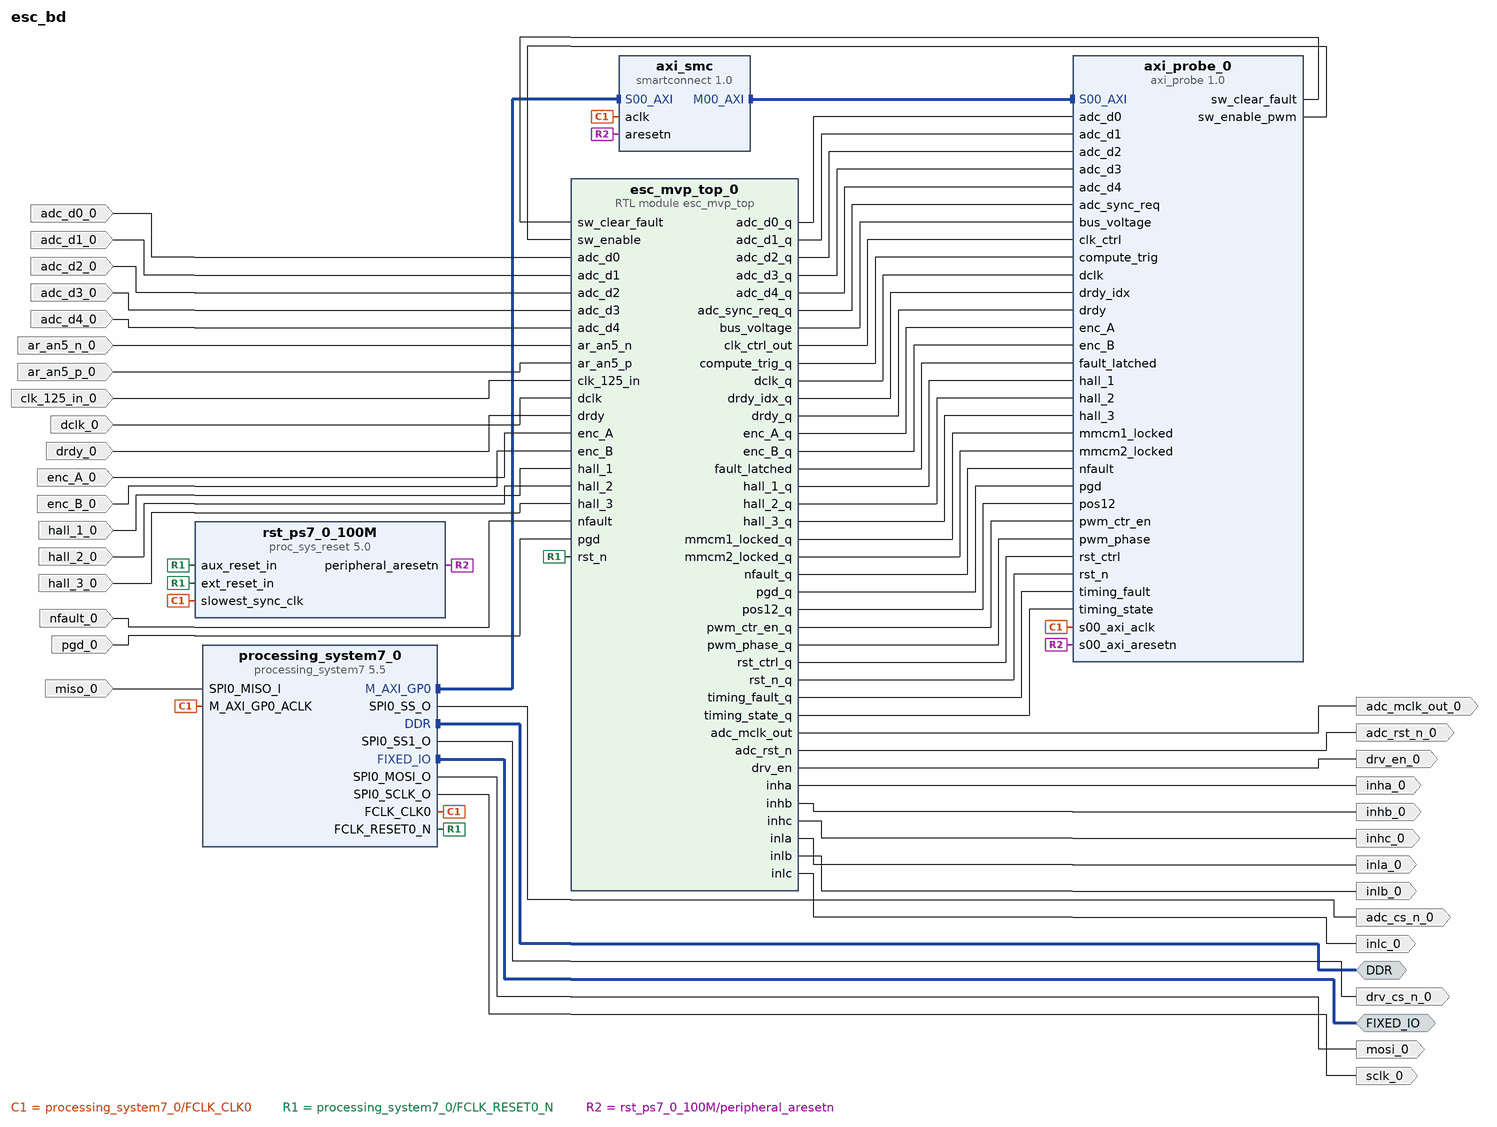
[diagram p0: block diagram of the top level]
# Vivado block design esc_bd, xc7z020clg400-1, Vivado 2024.2
create_bd_design esc_bd

create_bd_intf_port -mode Master -vlnv xilinx.com:interface:ddrx_rtl:1.0 DDR
create_bd_intf_port -mode Master -vlnv xilinx.com:display_processing_system7:fixedio_rtl:1.0 FIXED_IO
create_bd_port -dir I clk_125_in_0
create_bd_port -dir I dclk_0
create_bd_port -dir I hall_2_0
create_bd_port -dir I enc_B_0
create_bd_port -dir I enc_A_0
create_bd_port -dir I ar_an5_p_0
create_bd_port -dir I adc_d4_0
create_bd_port -dir I adc_d1_0
create_bd_port -dir I adc_d0_0
create_bd_port -dir I hall_1_0
create_bd_port -dir I ar_an5_n_0
create_bd_port -dir I adc_d3_0
create_bd_port -dir I adc_d2_0
create_bd_port -dir I drdy_0
create_bd_port -dir I miso_0
create_bd_port -dir I hall_3_0
create_bd_port -dir I nfault_0
create_bd_port -dir I pgd_0
create_bd_port -dir O sclk_0
create_bd_port -dir O drv_en_0
create_bd_port -dir O inha_0
create_bd_port -dir O adc_mclk_out_0
create_bd_port -dir O inlb_0
create_bd_port -dir O inhc_0
create_bd_port -dir O drv_cs_n_0
create_bd_port -dir O mosi_0
create_bd_port -dir O inla_0
create_bd_port -dir O inhb_0
create_bd_port -dir O inlc_0
create_bd_port -dir O adc_cs_n_0
create_bd_port -dir O -type rst adc_rst_n_0

create_bd_cell -type ip -vlnv xilinx.com:ip:processing_system7:5.5 processing_system7_0
set_property -dict [list \
  CONFIG.PCW_APU_PERIPHERAL_FREQMHZ 650 \
  CONFIG.PCW_CRYSTAL_PERIPHERAL_FREQMHZ 50 \
  CONFIG.PCW_ENET0_ENET0_IO {MIO 16 .. 27} \
  CONFIG.PCW_ENET0_GRP_MDIO_ENABLE 1 \
  CONFIG.PCW_ENET0_GRP_MDIO_IO {MIO 52 .. 53} \
  CONFIG.PCW_ENET0_PERIPHERAL_ENABLE 1 \
  CONFIG.PCW_ENET0_RESET_ENABLE 1 \
  CONFIG.PCW_ENET0_RESET_IO {MIO 9} \
  CONFIG.PCW_ENET_RESET_ENABLE 1 \
  CONFIG.PCW_ENET_RESET_SELECT {Share reset pin} \
  CONFIG.PCW_FPGA0_PERIPHERAL_FREQMHZ 100 \
  CONFIG.PCW_FPGA1_PERIPHERAL_FREQMHZ 50 \
  CONFIG.PCW_GPIO_MIO_GPIO_ENABLE 1 \
  CONFIG.PCW_GPIO_MIO_GPIO_IO MIO \
  CONFIG.PCW_I2C_RESET_ENABLE 1 \
  CONFIG.PCW_M_AXI_GP0_FREQMHZ 10 \
  CONFIG.PCW_PERIPHERAL_BOARD_PRESET part0 \
  CONFIG.PCW_PRESET_BANK1_VOLTAGE {LVCMOS 1.8V} \
  CONFIG.PCW_QSPI_GRP_FBCLK_ENABLE 1 \
  CONFIG.PCW_QSPI_GRP_FBCLK_IO {MIO 8} \
  CONFIG.PCW_QSPI_GRP_SINGLE_SS_ENABLE 1 \
  CONFIG.PCW_QSPI_GRP_SINGLE_SS_IO {MIO 1 .. 6} \
  CONFIG.PCW_QSPI_PERIPHERAL_ENABLE 1 \
  CONFIG.PCW_QSPI_QSPI_IO {MIO 1 .. 6} \
  CONFIG.PCW_SD0_GRP_CD_ENABLE 1 \
  CONFIG.PCW_SD0_GRP_CD_IO {MIO 47} \
  CONFIG.PCW_SD0_GRP_WP_ENABLE 0 \
  CONFIG.PCW_SD0_PERIPHERAL_ENABLE 1 \
  CONFIG.PCW_SD0_SD0_IO {MIO 40 .. 45} \
  CONFIG.PCW_SDIO_PERIPHERAL_FREQMHZ 50 \
  CONFIG.PCW_SINGLE_QSPI_DATA_MODE x4 \
  CONFIG.PCW_SPI0_PERIPHERAL_ENABLE 1 \
  CONFIG.PCW_SPI0_SPI0_IO EMIO \
  CONFIG.PCW_UART0_PERIPHERAL_ENABLE 1 \
  CONFIG.PCW_UART0_UART0_IO {MIO 14 .. 15} \
  CONFIG.PCW_UART1_PERIPHERAL_ENABLE 0 \
  CONFIG.PCW_UART_PERIPHERAL_FREQMHZ 100 \
  CONFIG.PCW_UIPARAM_DDR_BUS_WIDTH {16 Bit} \
  CONFIG.PCW_UIPARAM_DDR_FREQ_MHZ 525 \
  CONFIG.PCW_UIPARAM_DDR_PARTNO {MT41J256M16 RE-125} \
  CONFIG.PCW_USB0_PERIPHERAL_ENABLE 1 \
  CONFIG.PCW_USB0_RESET_ENABLE 1 \
  CONFIG.PCW_USB0_RESET_IO {MIO 46} \
  CONFIG.PCW_USB0_USB0_IO {MIO 28 .. 39} \
  CONFIG.PCW_USB_RESET_ENABLE 1 \
  CONFIG.PCW_USB_RESET_SELECT {Share reset pin} \
] [get_bd_cells processing_system7_0]
# 481 more settings of processing_system7_0 are not shown: defaults, MIO pin electricals, DDR timing, and values the tool derives
create_bd_cell -type ip -vlnv xilinx.com:user:axi_probe:1.0 axi_probe_0
create_bd_cell -type ip -vlnv xilinx.com:ip:smartconnect:1.0 axi_smc
set_property -dict {CONFIG.NUM_SI 1} [get_bd_cells axi_smc]
create_bd_cell -type ip -vlnv xilinx.com:ip:proc_sys_reset:5.0 rst_ps7_0_100M
create_bd_cell -type module -reference esc_mvp_top esc_mvp_top_0

# ---- connections ----

connect_bd_intf_net [get_bd_intf_pins axi_smc/M00_AXI] [get_bd_intf_pins axi_probe_0/S00_AXI]
connect_bd_intf_net [get_bd_intf_ports DDR] [get_bd_intf_pins processing_system7_0/DDR]
connect_bd_intf_net [get_bd_intf_ports FIXED_IO] [get_bd_intf_pins processing_system7_0/FIXED_IO]
connect_bd_intf_net [get_bd_intf_pins processing_system7_0/M_AXI_GP0] [get_bd_intf_pins axi_smc/S00_AXI]
connect_bd_net -net adc_d0_0_1 [get_bd_ports adc_d0_0] [get_bd_pins esc_mvp_top_0/adc_d0]
connect_bd_net -net adc_d1_0_1 [get_bd_ports adc_d1_0] [get_bd_pins esc_mvp_top_0/adc_d1]
connect_bd_net -net adc_d2_0_1 [get_bd_ports adc_d2_0] [get_bd_pins esc_mvp_top_0/adc_d2]
connect_bd_net -net adc_d3_0_1 [get_bd_ports adc_d3_0] [get_bd_pins esc_mvp_top_0/adc_d3]
connect_bd_net -net adc_d4_0_1 [get_bd_ports adc_d4_0] [get_bd_pins esc_mvp_top_0/adc_d4]
connect_bd_net -net ar_an5_n_0_1 [get_bd_ports ar_an5_n_0] [get_bd_pins esc_mvp_top_0/ar_an5_n]
connect_bd_net -net ar_an5_p_0_1 [get_bd_ports ar_an5_p_0] [get_bd_pins esc_mvp_top_0/ar_an5_p]
connect_bd_net [get_bd_pins axi_probe_0/sw_clear_fault] [get_bd_pins esc_mvp_top_0/sw_clear_fault]
connect_bd_net [get_bd_pins axi_probe_0/sw_enable_pwm] [get_bd_pins esc_mvp_top_0/sw_enable]
connect_bd_net -net clk_125_in_0_1 [get_bd_ports clk_125_in_0] [get_bd_pins esc_mvp_top_0/clk_125_in]
connect_bd_net -net dclk_0_1 [get_bd_ports dclk_0] [get_bd_pins esc_mvp_top_0/dclk]
connect_bd_net -net drdy_0_1 [get_bd_ports drdy_0] [get_bd_pins esc_mvp_top_0/drdy]
connect_bd_net -net enc_A_0_1 [get_bd_ports enc_A_0] [get_bd_pins esc_mvp_top_0/enc_A]
connect_bd_net -net enc_B_0_1 [get_bd_ports enc_B_0] [get_bd_pins esc_mvp_top_0/enc_B]
connect_bd_net [get_bd_pins esc_mvp_top_0/adc_d0_q] [get_bd_pins axi_probe_0/adc_d0]
connect_bd_net [get_bd_pins esc_mvp_top_0/adc_d1_q] [get_bd_pins axi_probe_0/adc_d1]
connect_bd_net [get_bd_pins esc_mvp_top_0/adc_d2_q] [get_bd_pins axi_probe_0/adc_d2]
connect_bd_net [get_bd_pins esc_mvp_top_0/adc_d3_q] [get_bd_pins axi_probe_0/adc_d3]
connect_bd_net [get_bd_pins esc_mvp_top_0/adc_d4_q] [get_bd_pins axi_probe_0/adc_d4]
connect_bd_net [get_bd_pins esc_mvp_top_0/adc_mclk_out] [get_bd_ports adc_mclk_out_0]
connect_bd_net [get_bd_pins esc_mvp_top_0/adc_rst_n] [get_bd_ports adc_rst_n_0]
connect_bd_net [get_bd_pins esc_mvp_top_0/adc_sync_req_q] [get_bd_pins axi_probe_0/adc_sync_req]
connect_bd_net [get_bd_pins esc_mvp_top_0/bus_voltage] [get_bd_pins axi_probe_0/bus_voltage]
connect_bd_net [get_bd_pins esc_mvp_top_0/clk_ctrl_out] [get_bd_pins axi_probe_0/clk_ctrl]
connect_bd_net [get_bd_pins esc_mvp_top_0/compute_trig_q] [get_bd_pins axi_probe_0/compute_trig]
connect_bd_net [get_bd_pins esc_mvp_top_0/dclk_q] [get_bd_pins axi_probe_0/dclk]
connect_bd_net [get_bd_pins esc_mvp_top_0/drdy_idx_q] [get_bd_pins axi_probe_0/drdy_idx]
connect_bd_net [get_bd_pins esc_mvp_top_0/drdy_q] [get_bd_pins axi_probe_0/drdy]
connect_bd_net [get_bd_pins esc_mvp_top_0/drv_en] [get_bd_ports drv_en_0]
connect_bd_net [get_bd_pins esc_mvp_top_0/enc_A_q] [get_bd_pins axi_probe_0/enc_A]
connect_bd_net [get_bd_pins esc_mvp_top_0/enc_B_q] [get_bd_pins axi_probe_0/enc_B]
connect_bd_net [get_bd_pins esc_mvp_top_0/fault_latched] [get_bd_pins axi_probe_0/fault_latched]
connect_bd_net [get_bd_pins esc_mvp_top_0/hall_1_q] [get_bd_pins axi_probe_0/hall_1]
connect_bd_net [get_bd_pins esc_mvp_top_0/hall_2_q] [get_bd_pins axi_probe_0/hall_2]
connect_bd_net [get_bd_pins esc_mvp_top_0/hall_3_q] [get_bd_pins axi_probe_0/hall_3]
connect_bd_net [get_bd_pins esc_mvp_top_0/inha] [get_bd_ports inha_0]
connect_bd_net [get_bd_pins esc_mvp_top_0/inhb] [get_bd_ports inhb_0]
connect_bd_net [get_bd_pins esc_mvp_top_0/inhc] [get_bd_ports inhc_0]
connect_bd_net [get_bd_pins esc_mvp_top_0/inla] [get_bd_ports inla_0]
connect_bd_net [get_bd_pins esc_mvp_top_0/inlb] [get_bd_ports inlb_0]
connect_bd_net [get_bd_pins esc_mvp_top_0/inlc] [get_bd_ports inlc_0]
connect_bd_net [get_bd_pins esc_mvp_top_0/mmcm1_locked_q] [get_bd_pins axi_probe_0/mmcm1_locked]
connect_bd_net [get_bd_pins esc_mvp_top_0/mmcm2_locked_q] [get_bd_pins axi_probe_0/mmcm2_locked]
connect_bd_net [get_bd_pins esc_mvp_top_0/nfault_q] [get_bd_pins axi_probe_0/nfault]
connect_bd_net [get_bd_pins esc_mvp_top_0/pgd_q] [get_bd_pins axi_probe_0/pgd]
connect_bd_net [get_bd_pins esc_mvp_top_0/pos12_q] [get_bd_pins axi_probe_0/pos12]
connect_bd_net [get_bd_pins esc_mvp_top_0/pwm_ctr_en_q] [get_bd_pins axi_probe_0/pwm_ctr_en]
connect_bd_net [get_bd_pins esc_mvp_top_0/pwm_phase_q] [get_bd_pins axi_probe_0/pwm_phase]
connect_bd_net [get_bd_pins esc_mvp_top_0/rst_ctrl_q] [get_bd_pins axi_probe_0/rst_ctrl]
connect_bd_net [get_bd_pins esc_mvp_top_0/rst_n_q] [get_bd_pins axi_probe_0/rst_n]
connect_bd_net [get_bd_pins esc_mvp_top_0/timing_fault_q] [get_bd_pins axi_probe_0/timing_fault]
connect_bd_net [get_bd_pins esc_mvp_top_0/timing_state_q] [get_bd_pins axi_probe_0/timing_state]
connect_bd_net -net hall_1_0_1 [get_bd_ports hall_1_0] [get_bd_pins esc_mvp_top_0/hall_1]
connect_bd_net -net hall_2_0_1 [get_bd_ports hall_2_0] [get_bd_pins esc_mvp_top_0/hall_2]
connect_bd_net -net hall_3_0_1 [get_bd_ports hall_3_0] [get_bd_pins esc_mvp_top_0/hall_3]
connect_bd_net -net miso_0_1 [get_bd_ports miso_0] [get_bd_pins processing_system7_0/SPI0_MISO_I]
connect_bd_net -net nfault_0_1 [get_bd_ports nfault_0] [get_bd_pins esc_mvp_top_0/nfault]
connect_bd_net -net pgd_0_1 [get_bd_ports pgd_0] [get_bd_pins esc_mvp_top_0/pgd]
connect_bd_net [get_bd_pins processing_system7_0/FCLK_CLK0] \
  [get_bd_pins processing_system7_0/M_AXI_GP0_ACLK] [get_bd_pins axi_smc/aclk] [get_bd_pins rst_ps7_0_100M/slowest_sync_clk] \
  [get_bd_pins axi_probe_0/s00_axi_aclk]
connect_bd_net [get_bd_pins processing_system7_0/FCLK_RESET0_N] \
  [get_bd_pins rst_ps7_0_100M/ext_reset_in] [get_bd_pins rst_ps7_0_100M/aux_reset_in] [get_bd_pins esc_mvp_top_0/rst_n]
connect_bd_net [get_bd_pins processing_system7_0/SPI0_MOSI_O] [get_bd_ports mosi_0]
connect_bd_net [get_bd_pins processing_system7_0/SPI0_SCLK_O] [get_bd_ports sclk_0]
connect_bd_net [get_bd_pins processing_system7_0/SPI0_SS1_O] [get_bd_ports drv_cs_n_0]
connect_bd_net [get_bd_pins processing_system7_0/SPI0_SS_O] [get_bd_ports adc_cs_n_0]
connect_bd_net [get_bd_pins rst_ps7_0_100M/peripheral_aresetn] [get_bd_pins axi_smc/aresetn] [get_bd_pins axi_probe_0/s00_axi_aresetn]

# ---- address map ----
assign_bd_address -offset 0x43C00000 -range 64K -target_address_space [get_bd_addr_spaces processing_system7_0/Data] [get_bd_addr_segs axi_probe_0/S00_AXI/S00_AXI_reg]

validate_bd_design
save_bd_design
